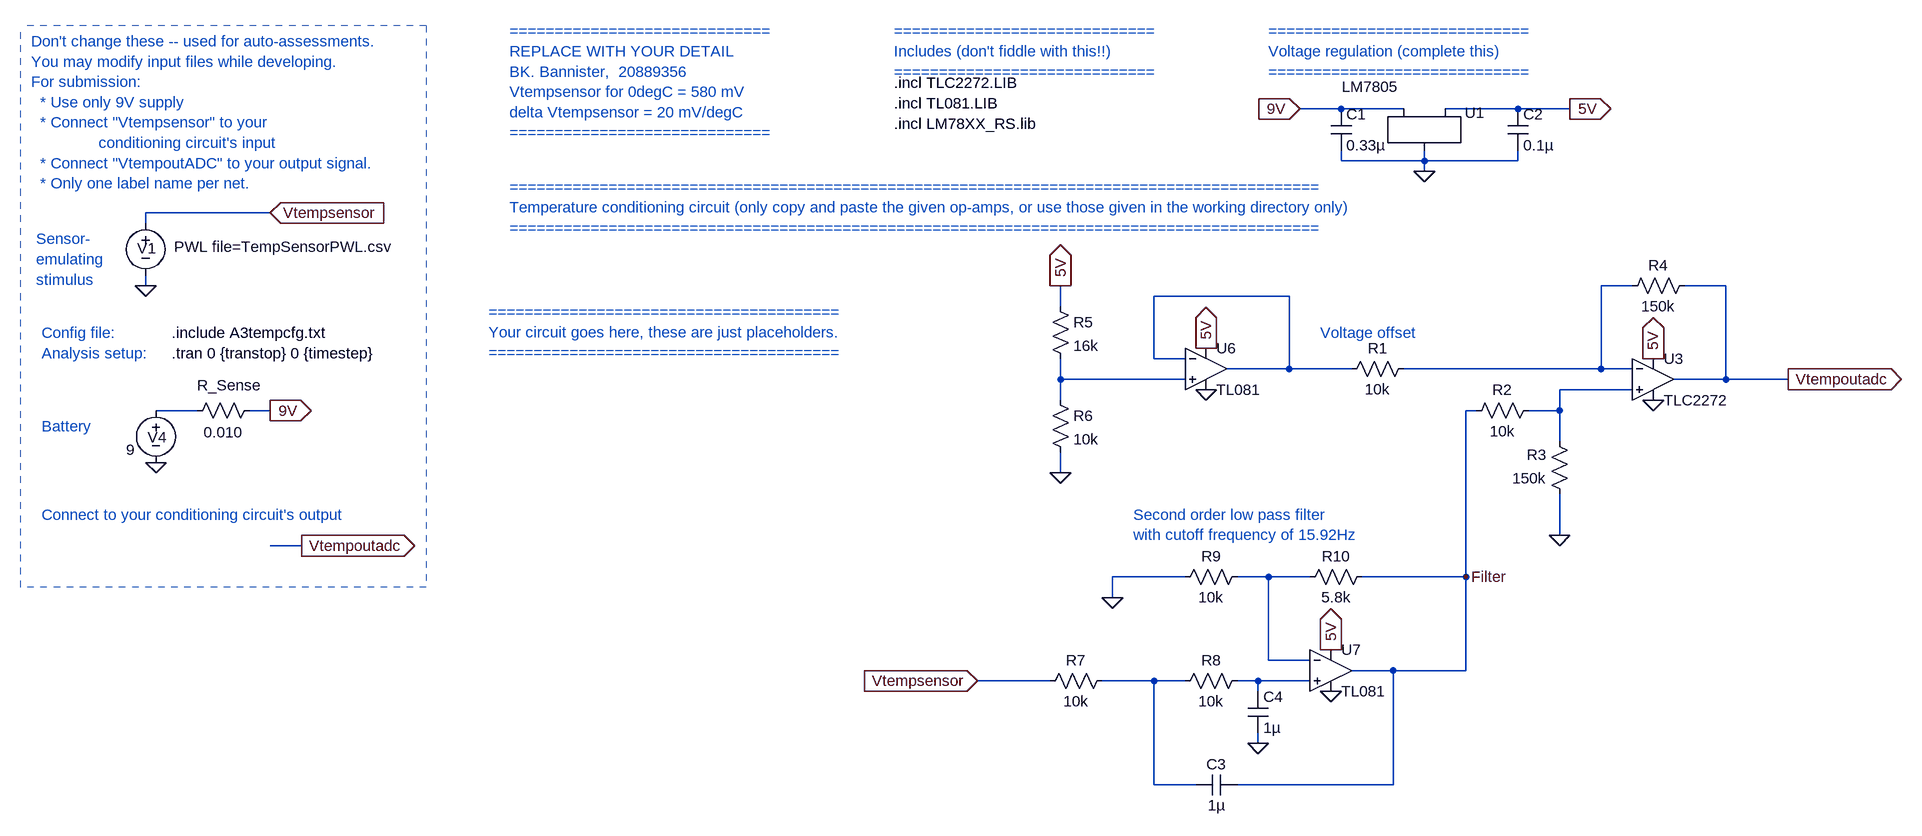
[diagram p0: schematic E344_A3_temp.asc]
E344_A3_temp.asc, the LTspice schematic file:
Version 4
SHEET 1 1824 680
WIRE -272 -1280 -336 -1280
WIRE -176 -1280 -272 -1280
WIRE 0 -1280 -112 -1280
WIRE 80 -1280 0 -1280
WIRE -272 -1200 -272 -1216
WIRE -144 -1200 -144 -1216
WIRE -144 -1200 -272 -1200
WIRE 0 -1200 0 -1216
WIRE 0 -1200 -144 -1200
WIRE -144 -1184 -144 -1200
WIRE -1920 -1120 -2112 -1120
WIRE -2112 -1104 -2112 -1120
WIRE -2112 -1008 -2112 -1024
WIRE 176 -1008 128 -1008
WIRE 320 -1008 256 -1008
WIRE -352 -992 -560 -992
WIRE -704 -976 -704 -1008
WIRE -560 -896 -560 -992
WIRE -512 -896 -560 -896
WIRE -352 -880 -352 -992
WIRE -352 -880 -448 -880
WIRE -256 -880 -352 -880
WIRE 128 -880 128 -1008
WIRE 128 -880 -176 -880
WIRE 176 -880 128 -880
WIRE -704 -864 -704 -896
WIRE -512 -864 -704 -864
WIRE 320 -864 320 -1008
WIRE 320 -864 240 -864
WIRE 416 -864 320 -864
WIRE 176 -848 64 -848
WIRE -704 -832 -704 -864
WIRE -2032 -816 -2096 -816
WIRE -1920 -816 -1952 -816
WIRE -64 -816 -80 -816
WIRE 64 -816 64 -848
WIRE 64 -816 16 -816
WIRE 64 -768 64 -816
WIRE -704 -720 -704 -752
WIRE 64 -624 64 -688
WIRE -1872 -608 -1920 -608
WIRE -512 -560 -624 -560
WIRE -384 -560 -432 -560
WIRE -320 -560 -384 -560
WIRE -80 -560 -80 -816
WIRE -80 -560 -240 -560
WIRE -624 -528 -624 -560
WIRE -384 -432 -384 -560
WIRE -320 -432 -384 -432
WIRE -192 -416 -256 -416
WIRE -80 -416 -80 -560
WIRE -80 -416 -192 -416
WIRE -720 -400 -832 -400
WIRE -560 -400 -640 -400
WIRE -512 -400 -560 -400
WIRE -400 -400 -432 -400
WIRE -320 -400 -400 -400
WIRE -400 -384 -400 -400
WIRE -400 -304 -400 -320
WIRE -560 -240 -560 -400
WIRE -496 -240 -560 -240
WIRE -192 -240 -192 -416
WIRE -192 -240 -432 -240
FLAG -2112 -1008 0
FLAG -1920 -1120 Vtempsensor
IOPIN -1920 -1120 In
FLAG -1920 -816 9V
IOPIN -1920 -816 Out
FLAG -2096 -736 0
FLAG -336 -1280 9V
IOPIN -336 -1280 In
FLAG -832 -400 Vtempsensor
IOPIN -832 -400 In
FLAG -144 -1184 0
FLAG 80 -1280 5V
IOPIN 80 -1280 Out
FLAG 416 -864 Vtempoutadc
IOPIN 416 -864 Out
FLAG -1872 -608 Vtempoutadc
IOPIN -1872 -608 Out
FLAG 208 -832 0
FLAG 208 -896 5V
IOPIN 208 -896 Out
FLAG -704 -720 0
FLAG -704 -1008 5V
IOPIN -704 -1008 Out
FLAG 64 -624 0
FLAG -480 -912 5V
IOPIN -480 -912 Out
FLAG -480 -848 0
FLAG -288 -384 0
FLAG -288 -448 5V
IOPIN -288 -448 Out
FLAG -400 -304 0
FLAG -624 -528 0
FLAG -80 -560 Filter
SYMBOL voltage -2112 -1120 R0
WINDOW 123 0 0 Left 0
WINDOW 39 0 0 Left 0
WINDOW 3 44 52 Left 2
WINDOW 0 -13 54 Left 2
SYMATTR Value PWL file=TempSensorPWL.csv
SYMATTR InstName V1
SYMBOL voltage -2096 -832 R0
WINDOW 123 24 44 Left 2
WINDOW 39 0 0 Left 0
WINDOW 3 -46 76 Left 2
WINDOW 0 -13 57 Left 2
SYMATTR Value 9
SYMATTR InstName V4
SYMBOL res -1936 -832 R90
WINDOW 0 -7 47 VBottom 2
WINDOW 3 34 56 VTop 2
SYMATTR InstName R_Sense
SYMATTR Value 0.010
SYMBOL LM7805 -144 -1264 R0
WINDOW 3 -83 -66 Top 2
SYMATTR InstName U1
SYMBOL res -160 -896 R90
WINDOW 0 0 56 VBottom 2
WINDOW 3 32 56 VTop 2
SYMATTR InstName R1
SYMATTR Value 10k
SYMBOL res 32 -832 R90
WINDOW 0 0 56 VBottom 2
WINDOW 3 32 56 VTop 2
SYMATTR InstName R2
SYMATTR Value 10k
SYMBOL res 80 -672 R180
WINDOW 0 36 76 Left 2
WINDOW 3 36 40 Left 2
SYMATTR InstName R3
SYMATTR Value 150k
SYMBOL res 160 -992 R270
WINDOW 0 32 56 VTop 2
WINDOW 3 0 56 VBottom 2
SYMATTR InstName R4
SYMATTR Value 150k
SYMBOL res -720 -992 R0
SYMATTR InstName R5
SYMATTR Value 16k
SYMBOL res -720 -848 R0
SYMATTR InstName R6
SYMATTR Value 10k
SYMBOL cap -432 -256 R90
WINDOW 0 0 32 VBottom 2
WINDOW 3 32 32 VTop 2
SYMATTR InstName C3
SYMATTR Value 1µ
SYMBOL res -624 -416 R90
WINDOW 0 0 56 VBottom 2
WINDOW 3 32 56 VTop 2
SYMATTR InstName R7
SYMATTR Value 10k
SYMBOL res -416 -416 R90
WINDOW 0 0 56 VBottom 2
WINDOW 3 32 56 VTop 2
SYMATTR InstName R8
SYMATTR Value 10k
SYMBOL cap -416 -384 R0
SYMATTR InstName C4
SYMATTR Value 1µ
SYMBOL res -416 -576 R90
WINDOW 0 0 56 VBottom 2
WINDOW 3 32 56 VTop 2
SYMATTR InstName R9
SYMATTR Value 10k
SYMBOL res -224 -576 R90
WINDOW 0 0 56 VBottom 2
WINDOW 3 32 56 VTop 2
SYMATTR InstName R10
SYMATTR Value 5.8k
SYMBOL opamp2 -480 -944 R0
SYMATTR InstName U6
SYMATTR Value TL081
SYMATTR SpiceModel TL081
SYMBOL opamp2 -288 -480 R0
SYMATTR InstName U7
SYMATTR Value TL081
SYMATTR SpiceModel TL081
SYMBOL opamp2 208 -928 R0
SYMATTR InstName U3
SYMATTR Value TLC2272
SYMATTR SpiceModel TLC2272
SYMBOL cap -288 -1280 R0
SYMATTR InstName C1
SYMATTR Value 0.33µ
SYMBOL cap -16 -1280 R0
SYMATTR InstName C2
SYMATTR Value 0.1µ
TEXT -2072 -904 Left 2 !.tran 0 {transtop} 0 {timestep}
TEXT -2072 -936 Left 2 !.include A3tempcfg.txt
TEXT -2288 -1384 Left 2 ;Don't change these -- used for auto-assessments.\nYou may modify input files while developing.\nFor submission: \n  * Use only 9V supply \n  * Connect "Vtempsensor" to your \n               conditioning circuit's input\n  * Connect "VtempoutADC" to your output signal.\n  * Only one label name per net.
TEXT -2272 -936 Left 2 ;Config file:
TEXT -2272 -904 Left 2 ;Analysis setup:
TEXT -2272 -792 Left 2 ;Battery
TEXT -2280 -1080 Left 2 ;Sensor-\nemulating \nstimulus
TEXT -1552 -1400 Left 2 ;=============================\nREPLACE WITH YOUR DETAIL\nBK. Bannister,  20889356\nVtempsensor for 0degC = 580 mV\ndelta Vtempsensor = 20 mV/degC\n=============================
TEXT -1552 -1160 Left 2 ;==========================================================================================\nTemperature conditioning circuit (only copy and paste the given op-amps, or use those given in the working directory only)\n==========================================================================================
TEXT -384 -1400 Left 2 ;=============================\nVoltage regulation (complete this)\n=============================
TEXT -960 -1320 Left 2 !.incl TLC2272.LIB\n.incl TL081.LIB\n.incl LM78XX_RS.lib
TEXT -2272 -656 Left 2 ;Connect to your conditioning circuit's output
TEXT -960 -1400 Left 2 ;=============================\nIncludes (don't fiddle with this!!)\n=============================
TEXT -1584 -968 Left 2 ;=======================================\nYour circuit goes here, these are just placeholders.\n=======================================
TEXT -304 -936 Left 2 ;Voltage offset
TEXT -592 -656 Left 2 ;Second order low pass filter\nwith cutoff frequency of 15.92Hz
LINE Normal -2304 -544 -2304 -1408 1
LINE Normal -1680 -1408 -1680 -544 1
LINE Normal -1680 -544 -2304 -544 1
LINE Normal -1680 -1408 -2304 -1408 1

The netlist it stands for:
* E344_A3_temp.asc
V1 Vtempsensor 0 PWL file=TempSensorPWL.csv
V4 N005 0 9
R_Sense 9V N005 0.010
XU1 9V 0 5V LM7805
R1 N001 N002 10k
R2 N004 Filter 10k
R3 0 N004 150k
R4 N001 Vtempoutadc 150k
R5 5V N003 16k
R6 N003 0 10k
C3 Filter N007 1µ
R7 N007 Vtempsensor 10k
R8 N008 N007 10k
C4 N008 0 1µ
R9 N006 0 10k
R10 Filter N006 5.8k
XU6 N003 N002 5V 0 N002 TL081 TL081  ; pins In+ In- V+ V- OUT
XU7 N008 N006 5V 0 Filter TL081 TL081  ; pins In+ In- V+ V- OUT
XU3 N004 N001 5V 0 Vtempoutadc TLC2272 TLC2272  ; pins In+ In- V+ V- OUT
C1 9V 0 0.33µ
C2 5V 0 0.1µ
.tran 0 {transtop} 0 {timestep}
.include A3tempcfg.txt
* Don't change these -- used for auto-assessments.
* You may modify input files while developing.
* For submission:
*   * Use only 9V supply
*   * Connect "Vtempsensor" to your
*                conditioning circuit's input
*   * Connect "VtempoutADC" to your output signal.
*   * Only one label name per net.
* Config file:
* Analysis setup:
* Battery
* Sensor-
* emulating
* stimulus
* =============================
* REPLACE WITH YOUR DETAIL
* BK. Bannister,  20889356
* Vtempsensor for 0degC = 580 mV
* delta Vtempsensor = 20 mV/degC
* =============================
* ==========================================================================================
* Temperature conditioning circuit (only copy and paste the given op-amps, or use those given in the working directory only)
* ==========================================================================================
* =============================
* Voltage regulation (complete this)
* =============================
.incl TLC2272.LIB
.incl TL081.LIB
.incl LM78XX_RS.lib
* Connect to your conditioning circuit's output
* =============================
* Includes (don't fiddle with this!!)
* =============================
* =======================================
* Your circuit goes here, these are just placeholders.
* =======================================
* Voltage offset
* Second order low pass filter
* with cutoff frequency of 15.92Hz
.backanno
.end